# Altium project SMAQ-Board_Design.PrjPcb (part 1 of 3)
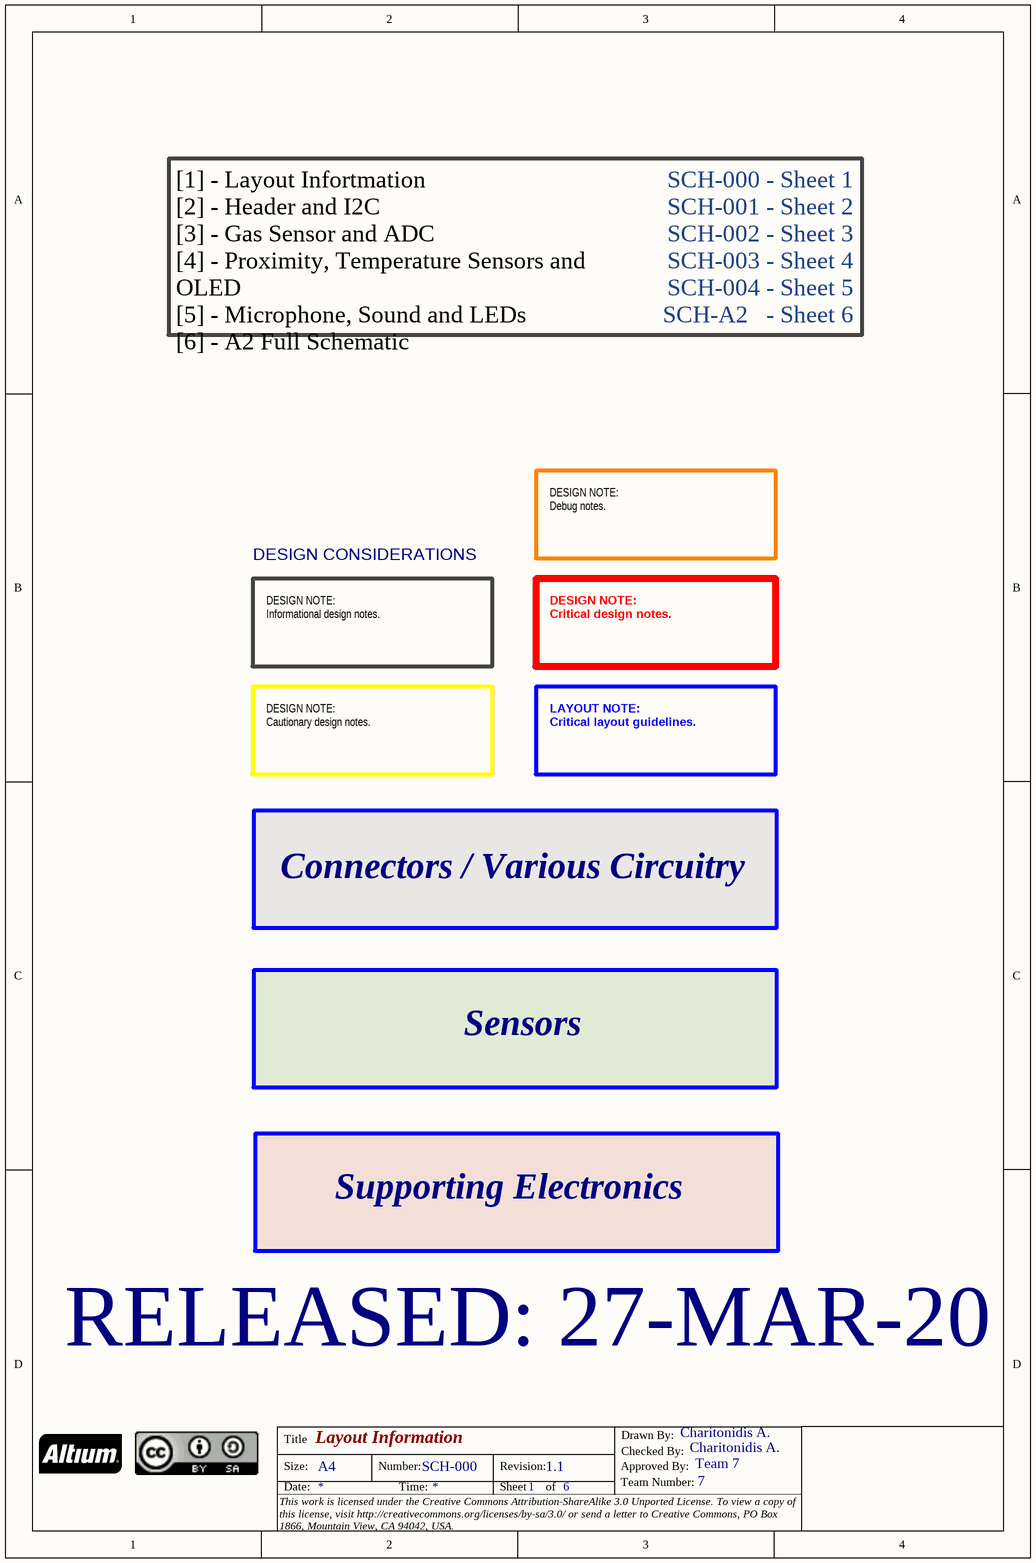
[diagram p0: [1] - Layout Information.SchDoc]
WEIGHT: N.M.; TeamNumber: 7; License: This work is licensed under the Creative Commons Attribution-ShareAlike 3.0 Unported License. To view a copy of this license, visit http://creativecommons.org/licenses/by-sa/3.0/ or send a letter to Creative Commons, PO Box 1866, Mountain View, CA 94042, USA.; documentnumber: 1; CompanyName: SMAQ -Smart Monitoring of Air Quality; =revision: 1.0; =DrawnBy: Alexandros Charitonidis
6 sheets, 110 parts. Net scope: global (net labels, ports and power ports of the same name join across sheets).
Board file: SMAQ_PCB_Design.PcbDoc
Sheets:
  [1] - Layout Information.SchDoc
  [2] - Header and I2C.SchDoc
  [3] - Gas Sensor and ADC.SchDoc
  [4] - Proximity,Temperature Sensors and OLED.SchDoc
  [5] - Microphone, Sound and LEDs.SchDoc
  [6] - A2 Full Schematic.SchDoc

## Sheet [1] - Layout Information.SchDoc: Layout Information
size A4 portrait; ApprovedBy: Team 7; CheckedBy: Charitonidis A.; Author: Charitonidis Alexandros; CompanyName: SMAQ; DrawnBy: Charitonidis A.; Engineer: Charitonidis Alexandros; Organization: SMAQ; Address1: Glasgow; DocumentNumber: SCH-000; Revision: 1.1; SheetNumber: 1; SheetTotal: 6

### Notes on the sheet
- SCH-000 - Sheet 1
  SCH-001 - Sheet 2
  SCH-002 - Sheet 3
  SCH-003 - Sheet 4
  SCH-004 - Sheet 5
  SCH-A2   - Sheet 6
- [1] - Layout Infortmation
  [2] - Header and I2C
  [3] - Gas Sensor and ADC
  [4] - Proximity, Temperature Sensors and OLED
  [5] - Microphone, Sound and LEDs
  [6] - A2 Full Schematic
- DESIGN CONSIDERATIONS
- DESIGN NOTE:
  Debug notes.
- DESIGN NOTE:
  Informational design notes.
- DESIGN NOTE:
  Critical design notes.
- DESIGN NOTE:
  Cautionary design notes.
- LAYOUT NOTE:
  Critical layout guidelines.
- Connectors / Various Circuitry
- Sensors
- Supporting Electronics
- RELEASED: 27-MAR-20
- Title
- Drawn By:
- Size:
- Date:
- A4
- Number:
- Time:
- Revision:
- Sheet
- of
- Approved By:
- Team Number:
- Checked By:
- This work is licensed under the Creative Commons Attribution-ShareAlike 3.0 Unported License. To view a copy of this license, visit http://creativecommons.org/licenses/by-sa/3.0/ or send a letter to Creative Commons, PO Box 1866, Mountain View, CA 94042, USA.

## Sheet [2] - Header and I2C.SchDoc: Header and I2C
size A4 portrait; ApprovedBy: Team 7; CheckedBy: Charitonidis A.; Author: Charitonidis Alexandros; DrawnBy: Charitonidis A.; Engineer: Charitonidis Alexandros; Organization: SMAQ; Address1: Glasgow; Address4: Australia 2086; DocumentNumber: SCH-001; Revision: 1.1; SheetNumber: 2; SheetTotal: 6
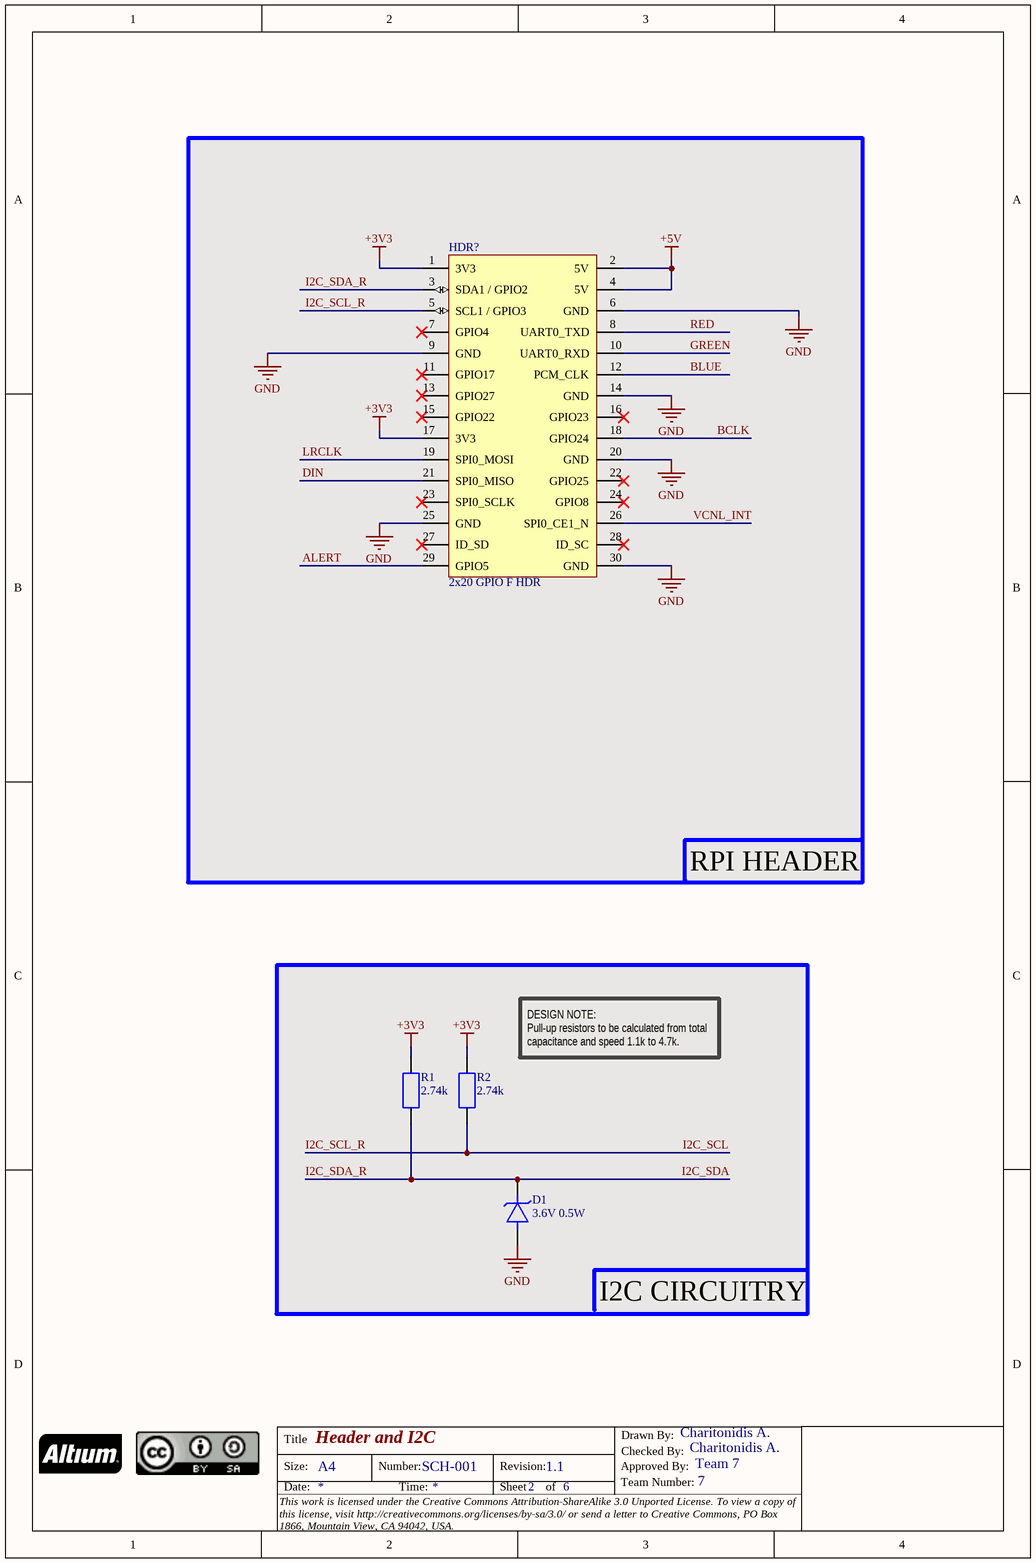
[diagram p1: [2] - Header and I2C.SchDoc]

### Parts
(Parts that share a designator on the sheet are numbered #1, #2 ... from top to bottom, then left to right.)
D1#1  3.6V 0.5W  [SOD-123]  (no BOM)
HDR?  2x20 GPIO F HDR  [2x20_Pi_Header]  (no BOM)
R1#1  2.74k  [R0805 (2012M)]  (no BOM)
R2#1  2.74k  [R0805 (2012M)]  (no BOM)

### Blocks framed on the sheet
RPI HEADER: HDR?
I2C CIRCUITRY: D1#1 R1#1 R2#1

### Nets
+3V3: HDR?.1(3V3) HDR?.17(3V3) R1#1.2 R2#1.2
+5V: HDR?.2(5V) HDR?.4(5V)
GND: D1#1.1 HDR?.6(GND) HDR?.9(GND) HDR?.14(GND) HDR?.20(GND) HDR?.25(GND) HDR?.30(GND)
ALERT: HDR?.29(GPIO5)
BCLK: HDR?.18(GPIO24)
BLUE: HDR?.12(PCM_CLK)
DIN: HDR?.21(SPI0_MISO)
GREEN: HDR?.10(UART0_RXD)
I2C_SCL: HDR?.5(SCL1_/_GPIO3) R2#1.1  [also labelled I2C_SCL_R]
I2C_SDA: D1#1.2 HDR?.3(SDA1_/_GPIO2) R1#1.1  [also labelled I2C_SDA_R]
LRCLK: HDR?.19(SPI0_MOSI)
RED: HDR?.8(UART0_TXD)
VCNL_INT: HDR?.26(SPI0_CE1_N)

Not connected (* = marked no-connect by the designer): HDR? 7(GPIO4)* 11(GPIO17)* 13(GPIO27)* 15(GPIO22)* 16(GPIO23)* 22(GPIO25)* 23(SPI0_SCLK)* 24(GPIO8)* 27(ID_SD)* 28(ID_SC)*

### Notes on the sheet
- DESIGN NOTE:
  Pull-up resistors to be calculated from total capacitance and speed 1.1k to 4.7k.
- Title
- Drawn By:
- Size:
- Date:
- A4
- Number:
- Time:
- Revision:
- Sheet
- of
- Approved By:
- Team Number:
- Checked By:
- This work is licensed under the Creative Commons Attribution-ShareAlike 3.0 Unported License. To view a copy of this license, visit http://creativecommons.org/licenses/by-sa/3.0/ or send a letter to Creative Commons, PO Box 1866, Mountain View, CA 94042, USA.

### Library data of the parts
D1#1 = BZT52B3V6-E3-08: Diode Zener Single 3.6V 2% 500mW 2-Pin SOD-123 T/R; Manufacturer 1: Vishay; Category 1: Zener Diodes; Max Power Dissipation: 410mW; Impedance: 80R; Zener Current: 100mA; Max Reverse Leakage Current: 100nA; Supplier 1: Mouser; Manufacturer Part Number 1: BZT52B3V6-E3-08; RoHS: Yes; Description 1: Diode Zener Single 3.6V 2% 500mW 2-Pin SOD-123 T/R; Stock 1: 29413; Mount: Surface Mount; Case/Package: SOD-123-2; Number of Pins: 2; Weight: 0.000363oz; Min Operating Temperature: -55°C; Max Operating Temperature: 150°C; Packaging: Tape and Reel; Package Quantity: 3000; Zener Voltage: 3.6V; Voltage Tolerance: 2%; Power Dissipation: 500mW; Element Configuration: Single; Tolerance: 2%; ComponentLink1URL: https://datasheet.ciiva.com/24095/bzt52-106265-24095710.pdf?src-supplier=Mouser; ComponentLink1Description: https://datasheet.ciiva.com/24095/bzt52-106265-24095710.pdf?src-supplier=Mouser; Supplier Part Number 1: 78-BZT52B3V6-E3-08
HDR? = 2X20 Female Header: GPIO FEMALE HEADER RASPBERRY PI; Manufacturer 1: Adafruit Industries; Manufacturer Part Number 1: 2222; Supplier 1: Mouser; RoHS: No; Description 1: GPIO FEMALE HEADER RASPBERRY PI; Stock 1: 1767; ComponentLink1URL: https://cdn-shop.adafruit.com/product-files/2222/00587.pdf?src-supplier=Digi-Key; ComponentLink1Description: https://cdn-shop.adafruit.com/product-files/2222/00587.pdf?src-supplier=Digi-Key; Supplier Part Number 1: 485-2222
R1#1 R2#1 = ERA-6AEB2741V: Surface Mount Chip Resistor, Thin Film, AEC-Q200 ERA Series, 2.74 kohm, 125 mW, 0.1%, 100 V; Manufacturer 1: Panasonic; Category 1: Chip SMD Resistors; Resistance: 2.74kR; Temperature Coefficient: 25ppm/°C; Power Rating: 125mW; Voltage Rating: 100V; Supplier 1: Farnell; Manufacturer Part Number 1: ERA-6AEB2741V; RoHS: Yes; Description 1: Surface Mount Chip Resistor, Thin Film, AEC-Q200 ERA Series, 2.74 kohm, 125 mW, 0.1%, 100 V; Stock 1: 20000; Pricing 1: 5000=0.02100 (GBP); Mount: Surface Mount; Case/Package: 0805; Number of Pins: 2; Contact Plating: Tin; Case Code (Imperial): 0805; Case Code (Metric): 2012; Min Operating Temperature: -55°C; Max Operating Temperature: 155°C; Tolerance: 0.1%; Composition: Metal Film,Thin Film; Packaging: Tape and Reel; Package Quantity: 1; Number of Terminations: 2; Military Standard: Not; Termination: Solder; Max Power Dissipation: 125mW; Voltage Rating (DC): 100V; Features: Automotive AEC-Q200; Length: 2mm; Height: 0.5mm; Width: 1.25mm; Depth: 1.25mm; Radiation Hardening: No; Lead Free: Lead Free; ComponentLink1URL: https://datasheet.ciiva.com/11812/0900766b80eb1d8c-11812023.pdf?src-supplier=RSComponents; ComponentLink1Description: https://datasheet.ciiva.com/11812/0900766b80eb1d8c-11812023.pdf?src-supplier=RSComponents; ComponentLink2URL: https://datasheet.ciiva.com/41450/001181270-da-01-en-widerstand-era-0805-2k74-0-1-5000st-41450431.pdf?src-supplier=Conrad; ComponentLink2Description: https://datasheet.ciiva.com/41450/001181270-da-01-en-widerstand-era-0805-2k74-0-1-5000st-41450431.pdf?src-supplier=Conrad; ComponentLink3URL: https://datasheet.ciiva.com/24025/aoa0000ce26-197354-24025606.pdf?src-supplier=Mouser; ComponentLink3Description: https://datasheet.ciiva.com/24025/aoa0000ce26-197354-24025606.pdf?src-supplier=Mouser; ComponentLink4URL: https://datasheet.ciiva.com/7763/485442-7763559.pdf?src-supplier=Element14; ComponentLink4Description: https://datasheet.ciiva.com/7763/485442-7763559.pdf?src-supplier=Element14; ComponentLink5URL: https://datasheet.ciiva.com/7763/485442-7763560.pdf?src-supplier=Element14; ComponentLink5Description: https://datasheet.ciiva.com/7763/485442-7763560.pdf?src-supplier=Element14; ComponentLink6URL: https://datasheet.ciiva.com/6129/485442-6129482.pdf?src-supplier=Farnell; ComponentLink6Description: https://datasheet.ciiva.com/6129/485442-6129482.pdf?src-supplier=Farnell; ComponentLink7URL: https://datasheet.ciiva.com/6129/485442-6129483.pdf?src-supplier=Farnell; ComponentLink7Description: https://datasheet.ciiva.com/6129/485442-6129483.pdf?src-supplier=Farnell; ComponentLink8URL: https://datasheet.ciiva.com/6129/485442-6129478.pdf?src-supplier=Farnell; ComponentLink8Description: https://datasheet.ciiva.com/6129/485442-6129478.pdf?src-supplier=Farnell; ComponentLink9URL: https://datasheet.ciiva.com/9196/aoa0000ce26-9196845.pdf?src-supplier=Avnet; ComponentLink9Description: https://datasheet.ciiva.com/9196/aoa0000ce26-9196845.pdf?src-supplier=Avnet; Supplier Part Number 1: 1810978

## Sheet [3] - Gas Sensor and ADC.SchDoc: Gas Sensor and ADC
size A4 portrait; ApprovedBy: Team 7; CheckedBy: Charitonidis A.; Author: Charitonidis Alexandros; CompanyName: SMAQ; DrawnBy: Charitonidis A.; Engineer: Charitonidis Alexandros; Organization: SMAQ; Address1: Glasgow; DocumentNumber: SCH-002; Revision: 1.1; SheetNumber: 3; SheetTotal: 6; TeamNumber: 7
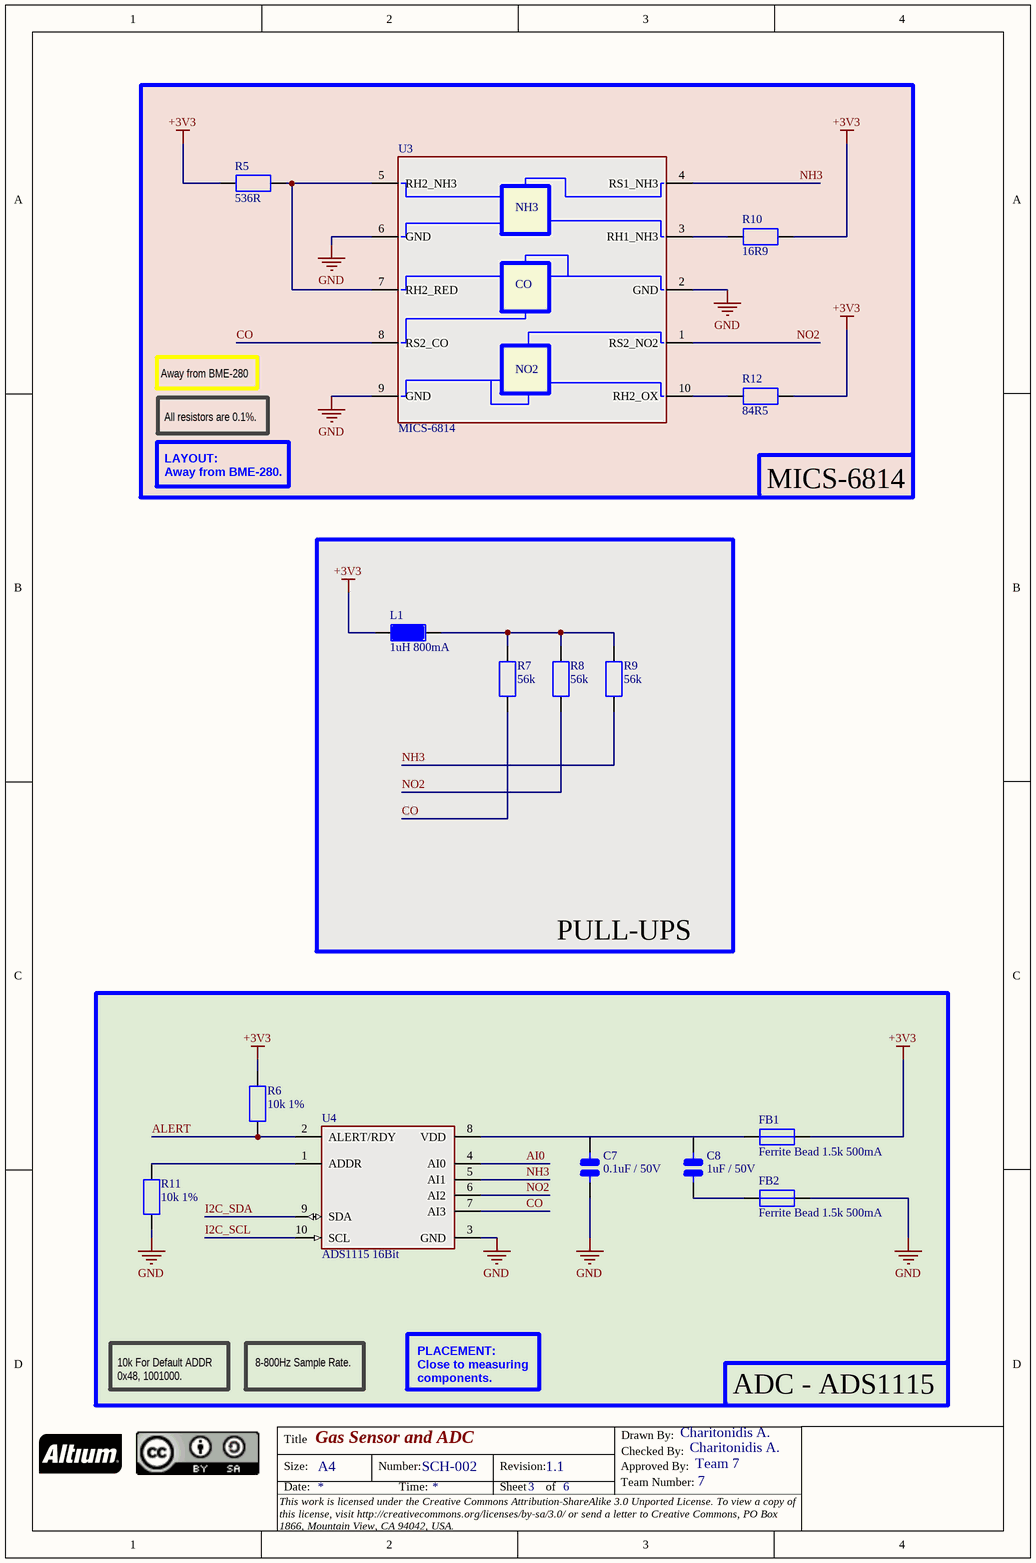
[diagram p2: [3] - Gas Sensor and ADC.SchDoc]

### Parts
(Parts that share a designator on the sheet are numbered #1, #2 ... from top to bottom, then left to right.)
C7#1  0.1uF / 50V  [C0805]  (no BOM)
C8#1  1uF / 50V  [C0805]  (no BOM)
FB1#1  Ferrite Bead 1.5k 500mA  [C0805]  (no BOM)
FB2#1  Ferrite Bead 1.5k 500mA  [C0805]  (no BOM)
L1#1  1uH 800mA  [C0805]  (no BOM)
R5#1  536R  [R0805 (2012M)]  (no BOM)
R6#1  10k 1%  [R0805 (2012M)]  (no BOM)
R7#1  56k  [R0805 (2012M)]  (no BOM)
R8#1  56k  [R0805 (2012M)]  (no BOM)
R9#1  56k  [R0805 (2012M)]  (no BOM)
R10#1  16R9  [R0805 (2012M)]  (no BOM)
R11#1  10k 1%  [R0805 (2012M)]  (no BOM)
R12#1  84R5  [R0805 (2012M)]  (no BOM)
U3#1  MICS-6814  [MICS-10]  (no BOM)
U4#1  ADS1115 16Bit  [VSSOP-10]  (no BOM)

### Blocks framed on the sheet
MICS-6814: R5#1 R10#1 R12#1 U3#1
PULL-UPS: L1#1 R7#1 R8#1 R9#1
ADC - ADS1115: C7#1 C8#1 FB1#1 FB2#1 R6#1 R11#1 U4#1

### Nets
+3V3: FB1#1.2 L1#1.1 R5#1.1 R6#1.2 R10#1.2 R12#1.2
GND: C7#1.1 FB2#1.2 R11#1.1 U3#1.2(GND) U3#1.6(GND) U3#1.9(GND) U4#1.3(GND)
AI0: U4#1.4(AI0)
ALERT: R6#1.1 U4#1.2(ALERT/RDY)
CO: R7#1.1 U3#1.8(RS2_CO) U4#1.7(AI3)
I2C_SCL: U4#1.10(SCL)
I2C_SDA: U4#1.9(SDA)
NH3: R9#1.1 U3#1.4(RS1_NH3) U4#1.5(AI1)
NO2: R8#1.1 U3#1.1(RS2_NO2) U4#1.6(AI2)
NetC7#1_2: C7#1.2 C8#1.2 FB1#1.1 U4#1.8(VDD)
NetC8#1_1: C8#1.1 FB2#1.1
NetL1#1_2: L1#1.2 R7#1.2 R8#1.2 R9#1.2
NetR5#1_2: R5#1.2 U3#1.5(RH2_NH3) U3#1.7(RH2_RED)
NetR10#1_1: R10#1.1 U3#1.3(RH1_NH3)
NetR11#1_2: R11#1.2 U4#1.1(ADDR)
NetR12#1_1: R12#1.1 U3#1.10(RH2_OX)

### Notes on the sheet
- Away from BME-280
- All resistors are 0.1%.
- LAYOUT:
  Away from BME-280.
- 10k For Default ADDR
  0x48, 1001000.
- 8-800Hz Sample Rate.
- PLACEMENT:
  Close to measuring components.
- Title
- Drawn By:
- Size:
- Date:
- A4
- Number:
- Time:
- Revision:
- Sheet
- of
- Approved By:
- Team Number:
- Checked By:
- This work is licensed under the Creative Commons Attribution-ShareAlike 3.0 Unported License. To view a copy of this license, visit http://creativecommons.org/licenses/by-sa/3.0/ or send a letter to Creative Commons, PO Box 1866, Mountain View, CA 94042, USA.
- (in symbol MICS-6814) NH3; CO; NO2

### Library data of the parts
C7#1 = 08055C104JAT4A: CAP CER 0.1UF 50V X7R 0805; Manufacturer 1: Kyocera AVX; Category 1: Ceramic Capacitors; Capacitance: 100nF; Tolerance: 5%; Supplier 1: Mouser; Manufacturer Part Number 1: 08055C104JAT4A; RoHS: Yes; Description 1: CAP CER 0.1UF 50V X7R 0805; Stock 1: 70357; Mount: Surface Mount; Case/Package: 0805; Number of Pins: 2; Case Code (Imperial): 0805; Case Code (Metric): 2012; Min Operating Temperature: -55°C; Max Operating Temperature: 125°C; Dielectric: X7R; Package Quantity: 10000; Voltage Rating: 50V; Packaging: Tape and Reel; Termination: SMD/SMT; Voltage Rating (DC): 50V; Length: 2.01mm; Depth: 1.25mm; Width: 0.049inch; Thickness: 0.037inch; Radiation Hardening: No; Lead Free: Lead Free; ComponentLink1URL: https://datasheet.ciiva.com/16326/cx7r-16326437.pdf?src-supplier=Future+Electronics; ComponentLink1Description: https://datasheet.ciiva.com/16326/cx7r-16326437.pdf?src-supplier=Future+Electronics; ComponentLink2URL: https://datasheet.ciiva.com/6277/cx7r-6277722.pdf?src-supplier=Digi-Key; ComponentLink2Description: https://datasheet.ciiva.com/6277/cx7r-6277722.pdf?src-supplier=Digi-Key; Supplier Part Number 1: 581-08055C104JAT4A
C8#1 = 08055C105JAT2A: Manufacturer 1: Kyocera AVX; Category 1: Capacitors; Dielectric: X7R; Tolerance: 5%; Supplier 1: Mouser; Manufacturer Part Number 1: 08055C105JAT2A; RoHS: No; Stock 1: 5621; Voltage: 50V; Supplier Part Number 1: 581-08055C105JAT2A
FB1#1 FB2#1 = MMZ2012Y152B: Ferrite Beads Multi-Layer 1.5KOhm 25% 100MHz 500mA 400mOhm DCR 0805; Manufacturer 1: TDK; Category 1: Inductors; Impedance: 1.5kR; DC Resistance (DCR): 400mR; Shielding: Unshielded; Supplier 1: Farnell; Manufacturer Part Number 1: MMZ2012Y152B; RoHS: Yes; Description 1: Ferrite Beads Multi-Layer 1.5KOhm 25% 100MHz 500mA 400mOhm DCR 0805; Pricing 1: 10=0.05740, 100=0.03680, 500=0.02670, 1000=0.02100, 2000=0.01900, 4000=0.01700, 20000=0.01600 (GBP); Case/Package: 0805; Number of Pins: 2; Case Code (Metric): 2012; Case Code (Imperial): 0805; Core Material: Ferrite; Material: Ferrite; Min Operating Temperature: -55°C; Max Operating Temperature: 125°C; Tolerance: 25%; Packaging: Tape and Reel; Package Quantity: 4000; Max DC Current: 500mA; Termination: SMD/SMT; Current Rating: 500mA; Test Frequency: 100MHz; DC Current: 500mA; Military Standard: Not; Frequency: 100MHz; Length: 2mm; Height: 0.85mm; Width: 1.25mm; Depth: 1.25mm; Radiation Hardening: No; REACH SVHC: No SVHC; Lead Free: Lead Free; ComponentLink1URL: https://datasheet.ciiva.com/11800/0900766b8082f891-11800917.pdf?src-supplier=RSComponents; ComponentLink1Description: https://datasheet.ciiva.com/11800/0900766b8082f891-11800917.pdf?src-supplier=RSComponents; ComponentLink2URL: https://datasheet.ciiva.com/34302/1868995-34302918.pdf?src-supplier=Jameco; ComponentLink2Description: https://datasheet.ciiva.com/34302/1868995-34302918.pdf?src-supplier=Jameco; ComponentLink3URL: https://datasheet.ciiva.com/15160/getdatasheetpartid-77343-15160260.pdf?src-supplier=Verical; ComponentLink3Description: https://datasheet.ciiva.com/15160/getdatasheetpartid-77343-15160260.pdf?src-supplier=Verical; ComponentLink4URL: https://datasheet.ciiva.com/16001/e9412-mmz2012-16001336.pdf?src-supplier=Onlinecomponents.com; ComponentLink4Description: https://datasheet.ciiva.com/16001/e9412-mmz2012-16001336.pdf?src-supplier=Onlinecomponents.com; Supplier Part Number 1: 1301674
L1#1 = KLZ2012MHR1R0HTD25: FIXED IND 1UH 800MA 130 MOHM SMD; Manufacturer 1: TDK; Supplier 1: Mouser; Manufacturer Part Number 1: KLZ2012MHR1R0HTD25; RoHS: No; Description 1: FIXED IND 1UH 800MA 130 MOHM SMD; Stock 1: 3633; ComponentLink1URL: https://product.tdk.com/info/en/catalog/datasheets/inductor_automotive_decoupling_klz2012-hr_en.pdf?src-supplier=Digi-Key; ComponentLink1Description: https://product.tdk.com/info/en/catalog/datasheets/inductor_automotive_decoupling_klz2012-hr_en.pdf?src-supplier=Digi-Key; Supplier Part Number 1: 810-KLZ2012MHR1R0HTD
R5#1 = ERA6AEB5360V: RES SMD 536 OHM 0.1% 1/8W 0805; Manufacturer 1: Panasonic; Category 1: Chip SMD Resistors; Power Rating: 125mW; Voltage Rating: 100V; Temperature Coefficient: 25ppm/°C; Supplier 1: Mouser; Manufacturer Part Number 1: ERA6AEB5360V; RoHS: Yes; Description 1: RES SMD 536 OHM 0.1% 1/8W 0805; Stock 1: 8172; Mount: Surface Mount; Case/Package: 0805; Number of Pins: 2; Case Code (Metric): 2012; Case Code (Imperial): 0805; Contact Plating: Tin; Min Operating Temperature: -55°C; Max Operating Temperature: 155°C; Tolerance: 0.1%; Packaging: Tape and Reel; Resistance: 536R; Package Quantity: 1; Composition: Thin Film,Metal Film; Number of Terminations: 2; Termination: SMD/SMT; Military Standard: Not; Max Power Dissipation: 125mW; Voltage Rating (DC): 100V; Features: Automotive AEC-Q200; Length: 2mm; Height: 0.5mm; Width: 1.25mm; Depth: 1.25mm; Radiation Hardening: No; REACH SVHC: No SVHC; Lead Free: Lead Free; ComponentLink1URL: https://datasheet.ciiva.com/11810/0900766b80eb1d8c-11810459.pdf?src-supplier=RSComponents; ComponentLink1Description: https://datasheet.ciiva.com/11810/0900766b80eb1d8c-11810459.pdf?src-supplier=RSComponents; ComponentLink2URL: https://datasheet.ciiva.com/41450/001181222-da-01-en-widerstand-era-0805-536r-0-1-5000st-41450380.pdf?src-supplier=Conrad; ComponentLink2Description: https://datasheet.ciiva.com/41450/001181222-da-01-en-widerstand-era-0805-536r-0-1-5000st-41450380.pdf?src-supplier=Conrad; ComponentLink3URL: https://datasheet.ciiva.com/9181/aoa0000ce26-9181246.pdf?src-supplier=Avnet; ComponentLink3Description: https://datasheet.ciiva.com/9181/aoa0000ce26-9181246.pdf?src-supplier=Avnet; Supplier Part Number 1: 667-ERA-6AEB5360V
R6#1 R11#1 = AT0805FRE0710KL: RES SMD 10K OHM 1% 1/8W 0805; Manufacturer 1: Yageo; Category 1: Chip SMD Resistors; Resistance: 10kR; Max Power Dissipation: 125mW; Temperature Coefficient: 50ppm/°C; Supplier 1: Mouser; Manufacturer Part Number 1: AT0805FRE0710KL; RoHS: Yes; Description 1: RES SMD 10K OHM 1% 1/8W 0805; Stock 1: 12821; Case/Package: 0805; Case Code (Metric): 2012; Case Code (Imperial): 0805; Min Operating Temperature: -55°C; Max Operating Temperature: 155°C; Packaging: Tape and Reel; Composition: Thin Film; Number of Terminations: 2; Tolerance: 1%; Features: Moisture Resistant,Automotive AEC-Q200,Anti-Sulfur; Length: 0.079inch; Height: 0.024inch; Width: 0.049inch; ComponentLink1URL: http://www.yageo.com/documents/recent/PYu-AT_51_RoHS_L_5.pdf?src-supplier=Digi-Key; ComponentLink1Description: http://www.yageo.com/documents/recent/PYu-AT_51_RoHS_L_5.pdf?src-supplier=Digi-Key; ComponentLink2URL: http://www.yageo.com/documents/recent/PYu-AT_51_RoHS_L-3.pdf?src-supplier=Digi-Key; ComponentLink2Description: http://www.yageo.com/documents/recent/PYu-AT_51_RoHS_L-3.pdf?src-supplier=Digi-Key; Supplier Part Number 1: 603-AT0805FRE0710KL
R7#1 R8#1 R9#1 = ERA-6AEB563V: RES SMD 56K OHM 0.1% 1/8W 0805; Manufacturer 1: Panasonic; Category 1: Chip SMD Resistors; Resistance: 56kR; Temperature Coefficient: 25ppm/°C; Power Rating: 125mW; Voltage Rating: 100V; Supplier 1: Mouser; Manufacturer Part Number 1: ERA-6AEB563V; RoHS: Yes; Description 1: RES SMD 56K OHM 0.1% 1/8W 0805; Stock 1: 14319; Mount: Surface Mount; Case/Package: 0805; Number of Pins: 2; Contact Plating: Tin; Case Code (Metric): 2012; Case Code (Imperial): 0805; Min Operating Temperature: -55°C; Max Operating Temperature: 155°C; Composition: Thin Film; Tolerance: 0.1%; Packaging: Tape and Reel; Package Quantity: 1; Termination: SMD/SMT; Number of Terminations: 2; Military Standard: Not; Max Power Dissipation: 125mW; Voltage Rating (DC): 100V; Features: Automotive AEC-Q200; Length: 2mm; Height: 0.5mm; Width: 1.25mm; Depth: 1.25mm; Radiation Hardening: No; REACH SVHC: No SVHC; Lead Free: Lead Free; ComponentLink1URL: https://datasheet.ciiva.com/11815/0900766b80beefcc-11815835.pdf?src-supplier=RSComponents; ComponentLink1Description: https://datasheet.ciiva.com/11815/0900766b80beefcc-11815835.pdf?src-supplier=RSComponents; ComponentLink2URL: https://datasheet.ciiva.com/26335/453572-da-01-en-widerstand-0805-era-26335719.pdf?src-supplier=Conrad; ComponentLink2Description: https://datasheet.ciiva.com/26335/453572-da-01-en-widerstand-0805-era-26335719.pdf?src-supplier=Conrad; ComponentLink3URL: https://datasheet.ciiva.com/6138/485442-6138597.pdf?src-supplier=Farnell; ComponentLink3Description: https://datasheet.ciiva.com/6138/485442-6138597.pdf?src-supplier=Farnell; ComponentLink4URL: https://datasheet.ciiva.com/48530/era-eng-tds-48530021.pdf?src-supplier=Distrelec; ComponentLink4Description: https://datasheet.ciiva.com/48530/era-eng-tds-48530021.pdf?src-supplier=Distrelec; ComponentLink5URL: https://datasheet.ciiva.com/6138/485442-6138602.pdf?src-supplier=Farnell; ComponentLink5Description: https://datasheet.ciiva.com/6138/485442-6138602.pdf?src-supplier=Farnell; ComponentLink6URL: https://datasheet.ciiva.com/7886/485442-7886650.pdf?src-supplier=Element14; ComponentLink6Description: https://datasheet.ciiva.com/7886/485442-7886650.pdf?src-supplier=Element14; ComponentLink7URL: https://datasheet.ciiva.com/7886/485442-7886651.pdf?src-supplier=Element14; ComponentLink7Description: https://datasheet.ciiva.com/7886/485442-7886651.pdf?src-supplier=Element14; ComponentLink8URL: https://datasheet.ciiva.com/30221/54aoa0000ce26-30221499.pdf?src-supplier=Onlinecomponents.com; ComponentLink8Description: https://datasheet.ciiva.com/30221/54aoa0000ce26-30221499.pdf?src-supplier=Onlinecomponents.com; ComponentLink9URL: https://datasheet.ciiva.com/6138/485442-6138604.pdf?src-supplier=Farnell; ComponentLink9Description: https://datasheet.ciiva.com/6138/485442-6138604.pdf?src-supplier=Farnell; ComponentLink10URL: https://datasheet.ciiva.com/7886/485442-7886652.pdf?src-supplier=Element14; ComponentLink10Description: https://datasheet.ciiva.com/7886/485442-7886652.pdf?src-supplier=Element14; ComponentLink11URL: https://datasheet.ciiva.com/17209/aoa0000ce26-17209230.pdf?src-supplier=Avnet+Europe; ComponentLink11Description: https://datasheet.ciiva.com/17209/aoa0000ce26-17209230.pdf?src-supplier=Avnet+Europe; Supplier Part Number 1: 667-ERA-6AEB563V
R10#1 = ERJ-P06F17R4V: Res Thick Film 0805 16.9 Ohm 1% 1/4W 300ppm/C Molded SMD Punched Carrier T/R; Manufacturer 1: Panasonic; Description 1: Res Thick Film 0805 17.4 Ohm 1% 1/4W 300ppm/C Molded SMD Punched Carrier T/R; Category 1: Chip SMD Resistors; Resistance: 17.4R; Power Rating: 500mW; Voltage Rating: 150V; Temperature Coefficient: 300ppm/°C; Voltage Rating (DC): 400V; Manufacturer Part Number 1: ERJ-P06F17R4V; RoHS: Yes; Mount: Surface Mount; Case/Package: 0805; Case Code (Imperial): 0805; Case Code (Metric): 2012; Min Operating Temperature: -55°C; Max Operating Temperature: 155°C; Tolerance: 1%; Packaging: Tape and Reel; Package Quantity: 5000; Composition: Thick Film; Termination: SMD/SMT; Length: 2mm; Height: 0.6mm; Width: 1.2mm; REACH SVHC: No SVHC; ComponentLink1URL: https://datasheet.ciiva.com/24064/aoa0000ce4-64075-24064442.pdf?src-supplier=Mouser; ComponentLink1Description: https://datasheet.ciiva.com/24064/aoa0000ce4-64075-24064442.pdf?src-supplier=Mouser; ComponentLink2URL: https://datasheet.ciiva.com/22720/1801181-22720492.pdf?src-supplier=Element14; ComponentLink2Description: https://datasheet.ciiva.com/22720/1801181-22720492.pdf?src-supplier=Element14; Supplier 1: Mouser; Supplier Part Number 1: 667-ERJ-P06D17R4V
R12#1 = ERA-6AEB84R5V: RES SMD 84.5 OHM 0.1% 1/8W 0805; Manufacturer 1: Panasonic; Category 1: Chip SMD Resistors; Resistance: 84.5R; Temperature Coefficient: 25ppm/°C; Power Rating: 125mW; Voltage Rating: 100V; Supplier 1: Mouser; Manufacturer Part Number 1: ERA-6AEB84R5V; RoHS: Yes; Description 1: RES SMD 84.5 OHM 0.1% 1/8W 0805; Stock 1: 6145; Mount: Surface Mount; Case/Package: 0805; Number of Pins: 2; Contact Plating: Tin; Case Code (Imperial): 0805; Case Code (Metric): 2012; Min Operating Temperature: -55°C; Max Operating Temperature: 155°C; Tolerance: 0.1%; Composition: Metal Film,Thin Film; Packaging: Tape and Reel; Package Quantity: 1; Termination: SMD/SMT; Number of Terminations: 2; Max Power Dissipation: 125mW; Voltage Rating (DC): 100V; Features: Automotive AEC-Q200; Length: 2mm; Height: 0.5mm; Width: 1.25mm; Depth: 1.25mm; Radiation Hardening: No; Lead Free: Lead Free; ComponentLink1URL: https://datasheet.ciiva.com/11815/0900766b80eb1d8c-11815865.pdf?src-supplier=RSComponents; ComponentLink1Description: https://datasheet.ciiva.com/11815/0900766b80eb1d8c-11815865.pdf?src-supplier=RSComponents; ComponentLink2URL: https://datasheet.ciiva.com/41450/001181159-da-01-en-widerstand-era-0805-84r5-0-1-5000st-41450316.pdf?src-supplier=Conrad; ComponentLink2Description: https://datasheet.ciiva.com/41450/001181159-da-01-en-widerstand-era-0805-84r5-0-1-5000st-41450316.pdf?src-supplier=Conrad; ComponentLink3URL: https://datasheet.ciiva.com/6075/485442-6075305.pdf?src-supplier=Farnell; ComponentLink3Description: https://datasheet.ciiva.com/6075/485442-6075305.pdf?src-supplier=Farnell; ComponentLink4URL: https://datasheet.ciiva.com/9187/aoa0000ce26-9187305.pdf?src-supplier=Avnet; ComponentLink4Description: https://datasheet.ciiva.com/9187/aoa0000ce26-9187305.pdf?src-supplier=Avnet; ComponentLink5URL: https://datasheet.ciiva.com/6075/485442-6075306.pdf?src-supplier=Farnell; ComponentLink5Description: https://datasheet.ciiva.com/6075/485442-6075306.pdf?src-supplier=Farnell; ComponentLink6URL: https://datasheet.ciiva.com/6075/485442-6075307.pdf?src-supplier=Farnell; ComponentLink6Description: https://datasheet.ciiva.com/6075/485442-6075307.pdf?src-supplier=Farnell; Supplier Part Number 1: 667-ERA-6AEB84R5V
U3#1 = MICS-6814: SHUT HEIGHT GAGE(119.5MM); Manufacturer 1: SGX Sensortech; Supplier 1: Farnell; Manufacturer Part Number 1: MICS-6814; RoHS: No; Description 1: SHUT HEIGHT GAGE(119.5MM); Pricing 1: 1=15.34000, 5=14.06000, 10=12.78000, 25=11.83000 (GBP); Supplier Part Number 1: 2925869
U4#1 = ADS1115IDGSR: IC ADC 16BIT 860SPS LP 10MSOP; Manufacturer 1: Texas Instruments; Category 1: Analog to Digital Converters (ADCs); Interface: I2C; Number of Bits: 16; Sampling Rate: 860S/s; Number of A/D Converters: 1; Resolution: 16b; Polarity: Bipolar; Min Supply Voltage: 2V; Max Supply Voltage: 5.5V; Supply Type: Single; Conversion Rate: 0.86KS/s; Number of Inputs: 4; Integral Nonlinearity (INL): 1LSB; Power Dissipation: 900uW; Supplier 1: Mouser; Manufacturer Part Number 1: ADS1115IDGSR; RoHS: Yes; Description 1: IC ADC 16BIT 860SPS LP 10MSOP; Stock 1: 14706; Case/Package: VSSOP; Number of Pins: 10; Contact Plating: Gold; Min Operating Temperature: -40°C; Max Operating Temperature: 125°C; Package Quantity: 2500; Packaging: Tape and Reel; Number of Converters: 1; Max Supply Voltage (DC): 5.5V; Min Supply Voltage (DC): 2V; Radiation Hardening: No; REACH SVHC: No SVHC; Lead Free: Lead Free; ComponentLink1URL: https://datasheet.ciiva.com/4031/47725463s8438921n7713-4031028.pdf?src-supplier=Arrow; ComponentLink1Description: https://datasheet.ciiva.com/4031/47725463s8438921n7713-4031028.pdf?src-supplier=Arrow; ComponentLink2URL: https://datasheet.ciiva.com/25993/sbas444b-25993205.pdf?src-supplier=Avnet+Europe; ComponentLink2Description: https://datasheet.ciiva.com/25993/sbas444b-25993205.pdf?src-supplier=Avnet+Europe; ComponentLink3URL: https://datasheet.ciiva.com/1304/ads1113-1304266.pdf?src-supplier=Digi-Key; ComponentLink3Description: https://datasheet.ciiva.com/1304/ads1113-1304266.pdf?src-supplier=Digi-Key; Supplier Part Number 1: 595-ADS1115IDGSR

## Sheet [4] - Proximity,Temperature Sensors and OLED.SchDoc: Proximity,Temperature Sensors+OLED
size A4 portrait; ApprovedBy: Team 7; CheckedBy: Charitonidis A.; Author: Charitonidis Alexandros; CompanyName: SMAQ; DrawnBy: Charitonidis A.; Engineer: Charitonidis Alexandros; Organization: SMAQ; Address1: Glasgow; Address3: NSW; DocumentNumber: SCH-003; Revision: 1.1; SheetNumber: 4; SheetTotal: 6; TeamNumber: 7
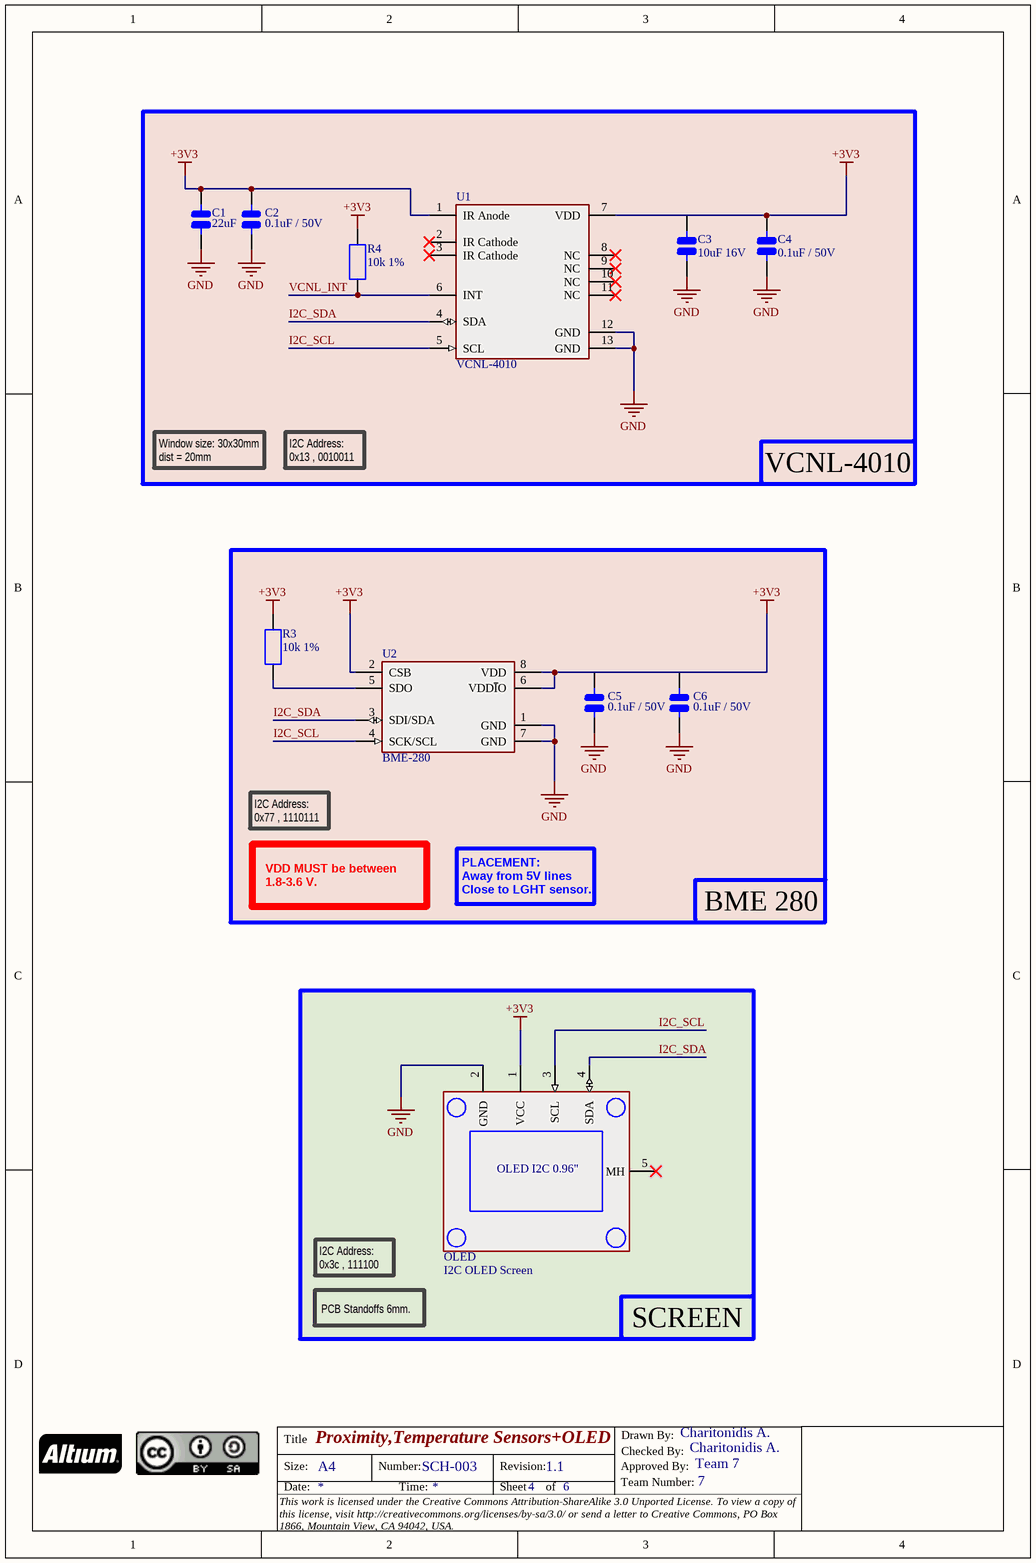
[diagram p3: [4] - Proximity,Temperature Sensors and OLED.SchDoc]

### Parts
(Parts that share a designator on the sheet are numbered #1, #2 ... from top to bottom, then left to right.)
C1#1  22uF  [C0805]  (no BOM)
C2#1  0.1uF / 50V  [C0805]  (no BOM)
C3#1  10uF 16V  [C0805]  (no BOM)
C4#1  0.1uF / 50V  [C0805]  (no BOM)
C5#1  0.1uF / 50V  [C0805]  (no BOM)
C6#1  0.1uF / 50V  [C0805]  (no BOM)
OLED#1  I2C OLED Screen  [OLED_I2C_0.96"]  (no BOM)
R3#1  10k 1%  [R0805 (2012M)]  (no BOM)
R4#1  10k 1%  [R0805 (2012M)]  (no BOM)
U1#1  VCNL-4010  [VCNL-4010]  (no BOM)
U2#1  BME-280  [LGA_8P_0.65MM]  (no BOM)

### Blocks framed on the sheet
VCNL-4010: C1#1 C2#1 C3#1 C4#1 R4#1 U1#1
BME 280: C5#1 C6#1 R3#1 U2#1
SCREEN: OLED#1

### Nets
+3V3: C1#1.2 C2#1.2 C3#1.2 C4#1.1 C5#1.2 C6#1.2 OLED#1.1(VCC) R3#1.2 R4#1.2 U1#1.1(IR_Anode) U1#1.7(VDD) U2#1.2(CSB) U2#1.6(VDD~{I}O) U2#1.8(VDD)
GND: C1#1.1 C2#1.1 C3#1.1 C4#1.2 C5#1.1 C6#1.1 OLED#1.2(GND) U1#1.12(GND) U1#1.13(GND) U2#1.1(GND) U2#1.7(GND)
I2C_SCL: OLED#1.3(SCL) U1#1.5(SCL) U2#1.4(SCK/SCL)
I2C_SDA: OLED#1.4(SDA) U1#1.4(SDA) U2#1.3(SDI/SDA)
VCNL_INT: R4#1.1 U1#1.6(INT)
NetR3#1_1: R3#1.1 U2#1.5(SDO)

Not connected (* = marked no-connect by the designer): OLED#1 5(MH)*; U1#1 2(IR_Cathode)* 3(IR_Cathode)* 8(NC)* 9(NC)* 10(NC)* 11(NC)*

### Notes on the sheet
- Window size: 30x30mm dist = 20mm
- I2C Address: 0x13 , 0010011
- I2C Address: 0x77 , 1110111
- VDD MUST be between 1.8-3.6 V.
- PLACEMENT:
  Away from 5V lines
  Close to LGHT sensor.
- I2C Address: 0x3c , 111100
- PCB Standoffs 6mm.
- Title
- Drawn By:
- Size:
- Date:
- A4
- Number:
- Time:
- Revision:
- Sheet
- of
- Approved By:
- Team Number:
- Checked By:
- This work is licensed under the Creative Commons Attribution-ShareAlike 3.0 Unported License. To view a copy of this license, visit http://creativecommons.org/licenses/by-sa/3.0/ or send a letter to Creative Commons, PO Box 1866, Mountain View, CA 94042, USA.
- (in symbol OLED_I2C_BREAKOUT) OLED I2C 0.96"

### Library data of the parts
C1#1 = C2012JB1A226M085AC: CAP CER 22UF 10V JB 0805; Manufacturer 1: TDK; Category 1: Ceramic Capacitors; Dielectric Material: Ceramic; Tolerance: 20%; Supplier 1: Mouser; Manufacturer Part Number 1: C2012JB1A226M085AC; RoHS: Yes; Description 1: CAP CER 22UF 10V JB 0805; Stock 1: 10381; Mount: Surface Mount; Case/Package: 0805; Case Code (Metric): 2012; Case Code (Imperial): 0805; Min Operating Temperature: -25°C; Max Operating Temperature: 85°C; Package Quantity: 1; Packaging: Tape and Reel; Capacitance: 22uF; Voltage Rating: 10V; Termination: SMD/SMT; Composition: Ceramic; Voltage Rating (DC): 10V; Length: 0.079inch; Height: 0.85mm; Width: 1.2mm; Thickness: 0.039inch; Lead Free: Lead Free; ComponentLink1URL: https://datasheet.ciiva.com/14908/tdkmlcccaprange-14908199.pdf?src-supplier=Digi-Key; ComponentLink1Description: https://datasheet.ciiva.com/14908/tdkmlcccaprange-14908199.pdf?src-supplier=Digi-Key; ComponentLink2URL: https://datasheet.ciiva.com/14908/tdkmlcccaprange-14908201.pdf?src-supplier=Digi-Key; ComponentLink2Description: https://datasheet.ciiva.com/14908/tdkmlcccaprange-14908201.pdf?src-supplier=Digi-Key; Supplier Part Number 1: 810-C2012JB1A226M08C
C2#1 C4#1 C5#1 C6#1 = 08055C104JAT4A: as C7#1 on sheet [3] - Gas Sensor and ADC; Supplier 1: Mouser; Manufacturer Part Number 1: 08055C104JAT4A; RoHS: Yes; Description 1: CAP CER 0.1UF 50V X7R 0805; Stock 1: 70357; Mount: Surface Mount; Case/Package: 0805; Number of Pins: 2; Case Code (Imperial): 0805; Case Code (Metric): 2012; Min Operating Temperature: -55°C; Max Operating Temperature: 125°C; Dielectric: X7R; Package Quantity: 10000; Voltage Rating: 50V; Packaging: Tape and Reel; Termination: SMD/SMT; Voltage Rating (DC): 50V; Length: 2.01mm; Depth: 1.25mm; Width: 0.049inch; Thickness: 0.037inch; Radiation Hardening: No; Lead Free: Lead Free; ComponentLink1URL: https://datasheet.ciiva.com/16326/cx7r-16326437.pdf?src-supplier=Future+Electronics; ComponentLink1Description: https://datasheet.ciiva.com/16326/cx7r-16326437.pdf?src-supplier=Future+Electronics; ComponentLink2URL: https://datasheet.ciiva.com/6277/cx7r-6277722.pdf?src-supplier=Digi-Key; ComponentLink2Description: https://datasheet.ciiva.com/6277/cx7r-6277722.pdf?src-supplier=Digi-Key; Supplier Part Number 1: 581-08055C104JAT4A
C3#1 = 0805YC106MAT2A: Manufacturer 1: Kyocera AVX; Supplier 1: Mouser; Manufacturer Part Number 1: 0805YC106MAT2A; RoHS: No; Stock 1: 1756; Supplier Part Number 1: 581-0805YC106MAT2A
OLED#1 = OLED_I2C_BREAKOUT
R3#1 R4#1 = AT0805FRE0710KL: as R6#1 on sheet [3] - Gas Sensor and ADC; Supplier 1: Mouser; Manufacturer Part Number 1: AT0805FRE0710KL; RoHS: Yes; Description 1: RES SMD 10K OHM 1% 1/8W 0805; Stock 1: 12821; Case/Package: 0805; Case Code (Metric): 2012; Case Code (Imperial): 0805; Min Operating Temperature: -55°C; Max Operating Temperature: 155°C; Packaging: Tape and Reel; Composition: Thin Film; Number of Terminations: 2; Tolerance: 1%; Features: Moisture Resistant,Automotive AEC-Q200,Anti-Sulfur; Length: 0.079inch; Height: 0.024inch; Width: 0.049inch; ComponentLink1URL: http://www.yageo.com/documents/recent/PYu-AT_51_RoHS_L_5.pdf?src-supplier=Digi-Key; ComponentLink1Description: http://www.yageo.com/documents/recent/PYu-AT_51_RoHS_L_5.pdf?src-supplier=Digi-Key; ComponentLink2URL: http://www.yageo.com/documents/recent/PYu-AT_51_RoHS_L-3.pdf?src-supplier=Digi-Key; ComponentLink2Description: http://www.yageo.com/documents/recent/PYu-AT_51_RoHS_L-3.pdf?src-supplier=Digi-Key; Supplier Part Number 1: 603-AT0805FRE0710KL
U1#1 = VCNL4010-GS08: SENS IR PROXIMITY AMB LT 12LLP; Manufacturer 1: Vishay Semiconductors; Category 1: Sensors; Operating Supply Voltage: 3.3V; Number of Channels: 1; Wavelength: 892nm; Min Supply Voltage: 2.5V; Max Supply Voltage: 3.6V; Sensing Distance: 200mm; Power Dissipation: 50mW; Output Type: I2C,Digital; Sensing Method: Optical; Output Configuration: Digital; Supplier 1: Mouser; Manufacturer Part Number 1: VCNL4010-GS08; RoHS: Yes; Description 1: SENS IR PROXIMITY AMB LT 12LLP; Stock 1: 15561; Mount: Surface Mount; Case/Package: SMD/SMT; Number of Pins: 13; Min Operating Temperature: -25°C; Max Operating Temperature: 85°C; Packaging: Tape and Reel; Package Quantity: 1800; Length: 3.95mm; Height: 0.75mm; Width: 3.95mm; Radiation Hardening: No; REACH SVHC: Unknown; Lead Free: Lead Free; ComponentLink1URL: https://datasheet.ciiva.com/4626/vcnl4010-97030-4626352.pdf?src-supplier=Mouser; ComponentLink1Description: https://datasheet.ciiva.com/4626/vcnl4010-97030-4626352.pdf?src-supplier=Mouser; ComponentLink2URL: https://datasheet.ciiva.com/7617/vcnl4010-7617985.pdf?src-supplier=Element14; ComponentLink2Description: https://datasheet.ciiva.com/7617/vcnl4010-7617985.pdf?src-supplier=Element14; ComponentLink3URL: https://datasheet.ciiva.com/15230/vcnl4010-15230062.pdf?src-supplier=Arrow+Europe; ComponentLink3Description: https://datasheet.ciiva.com/15230/vcnl4010-15230062.pdf?src-supplier=Arrow+Europe; ComponentLink4URL: https://datasheet.ciiva.com/16225/vcnl4010-16225925.pdf?src-supplier=Future+Electronics; ComponentLink4Description: https://datasheet.ciiva.com/16225/vcnl4010-16225925.pdf?src-supplier=Future+Electronics; ComponentLink5URL: https://datasheet.ciiva.com/14650/vcnl4010-14650582.pdf?src-supplier=Element14; ComponentLink5Description: https://datasheet.ciiva.com/14650/vcnl4010-14650582.pdf?src-supplier=Element14; ComponentLink6URL: https://datasheet.ciiva.com/2819/vcnl4010-2819260.pdf?src-supplier=Digi-Key; ComponentLink6Description: https://datasheet.ciiva.com/2819/vcnl4010-2819260.pdf?src-supplier=Digi-Key; ComponentLink7URL: https://datasheet.ciiva.com/2819/vcnl4010-2819261.pdf?src-supplier=Digi-Key; ComponentLink7Description: https://datasheet.ciiva.com/2819/vcnl4010-2819261.pdf?src-supplier=Digi-Key; ComponentLink8URL: https://datasheet.ciiva.com/25912/vcnl4010-25912077.pdf?src-supplier=Avnet+Europe; ComponentLink8Description: https://datasheet.ciiva.com/25912/vcnl4010-25912077.pdf?src-supplier=Avnet+Europe; ComponentLink9URL: https://datasheet.ciiva.com/2819/vcnl4010-2819262.pdf?src-supplier=Digi-Key; ComponentLink9Description: https://datasheet.ciiva.com/2819/vcnl4010-2819262.pdf?src-supplier=Digi-Key; ComponentLink10URL: https://datasheet.ciiva.com/3275/vcnl4010-3275278.pdf?src-supplier=Avnet; ComponentLink10Description: https://datasheet.ciiva.com/3275/vcnl4010-3275278.pdf?src-supplier=Avnet; Supplier Part Number 1: 78-VCNL4010-GS08
U2#1 = BME280: Pressure, Temperature and Humidity Sensor Digital Output 1.8V 8-Pin LGA T/R; Manufacturer 1: Bosch; Category 1: Pressure Sensors; Manufacturer Part Number 1: BME280; RoHS: No; Description 1: Pressure, Temperature and Humidity Sensor Digital Output 1.8V 8-Pin LGA T/R; Stock 1: 22089; Case/Package: LGA; Number of Pins: 8; Lead Free: Lead Free; ComponentLink1URL: https://ae-bst.resource.bosch.com/media/_tech/media/product_flyer/BME280_Productflyer_BST_20170109.pdf?src-supplier=Future+Electronics; ComponentLink1Description: https://ae-bst.resource.bosch.com/media/_tech/media/product_flyer/BME280_Productflyer_BST_20170109.pdf?src-supplier=Future+Electronics; ComponentLink2URL: https://ae-bst.resource.bosch.com/media/_tech/media/datasheets/BST-BME280-DS002.pdf?src-supplier=Digi-Key; ComponentLink2Description: https://ae-bst.resource.bosch.com/media/_tech/media/datasheets/BST-BME280-DS002.pdf?src-supplier=Digi-Key; ComponentLink3URL: https://ae-bst.resource.bosch.com/media/_tech/media/product_flyer/BME280_Productflyer_BST_20170109.pdf?src-supplier=Arrow; ComponentLink3Description: https://ae-bst.resource.bosch.com/media/_tech/media/product_flyer/BME280_Productflyer_BST_20170109.pdf?src-supplier=Arrow; ComponentLink4URL: https://ae-bst.resource.bosch.com/media/_tech/media/product_flyer/BME280_Productflyer_BST_20170109.pdf?src-supplier=Mouser; ComponentLink4Description: https://ae-bst.resource.bosch.com/media/_tech/media/product_flyer/BME280_Productflyer_BST_20170109.pdf?src-supplier=Mouser; ComponentLink5URL: https://ae-bst.resource.bosch.com/media/_tech/media/product_flyer/BME280_Productflyer_BST_20170109.pdf?src-supplier=Rutronik; ComponentLink5Description: https://ae-bst.resource.bosch.com/media/_tech/media/product_flyer/BME280_Productflyer_BST_20170109.pdf?src-supplier=Rutronik; ComponentLink6URL: https://ae-bst.resource.bosch.com/media/_tech/media/product_flyer/BME280_Productflyer_BST_20170109.pdf?src-supplier=NAC+Semi; ComponentLink6Description: https://ae-bst.resource.bosch.com/media/_tech/media/product_flyer/BME280_Productflyer_BST_20170109.pdf?src-supplier=NAC+Semi; Supplier 1: Mouser; Supplier Part Number 1: 262-BME280